# Altium schematic sheet OMD_CAN_VERT.SchDoc
size A4; Organization: Altium Limited; Address1: L3, 12a Rodborough Rd; Address2: Frenchs Forest; Address3: NSW; Address4: Australia 2086
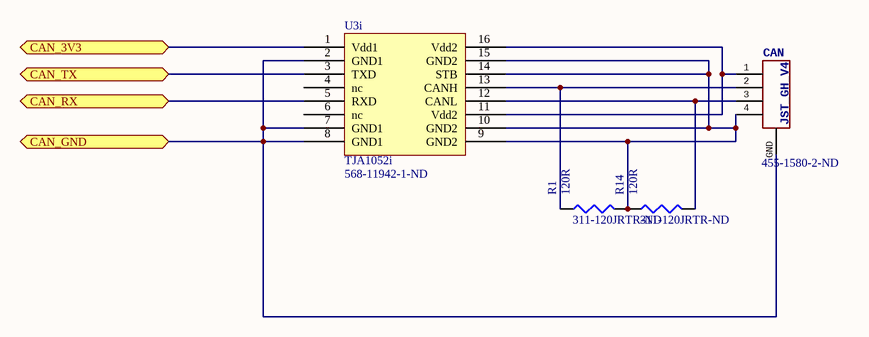
[diagram p0: OMD_CAN_VERT.SchDoc]

## Parts
CAN  JST_GH_V4  Supplier Part Number 1: 455-1580-2-ND  [JST_GH_V4]
R1  value 120R  Supplier Part Number 1: 311-120JRTR-ND  [R0402]  (hidden comment: RES SMD 120 OHM 5% 1/16W 0402)  (no BOM)
R14  value 120R  Supplier Part Number 1: 311-120JRTR-ND  [R0402]  (hidden comment: RES SMD 120 OHM 5% 1/16W 0402)  (no BOM)
U3i  TJA1052i  Supplier Part Number 1: 568-11942-1-ND  [TJA1052i]

## Ports
CAN_3V3, CAN_GND, CAN_RX, CAN_TX

## Nets
CAN_3V3: U3i.1(Vdd1) ; port CAN_3V3
CAN_GND: CAN.GND U3i.2(GND1) U3i.7(GND1) U3i.8(GND1) ; port CAN_GND
CAN_RX: U3i.5(RXD) ; port CAN_RX
CAN_TX: U3i.3(TXD) ; port CAN_TX
NetCAN_1: CAN.1 U3i.11(Vdd2) U3i.16(Vdd2)
NetCAN_2: CAN.2 R1.1 U3i.13(CANH)
NetCAN_3: CAN.3 R14.2 U3i.12(CANL)
NetCAN_4: CAN.4 R1.2 R14.1 U3i.9(GND2) U3i.10(GND2) U3i.14(STB) U3i.15(GND2)

Not connected (* = marked no-connect by the designer): U3i 4(nc) 6(nc)

## Notes on the sheet
- https://github.com/OpenMotorDrive
- https://creativecommons.org/licenses/by-nc-sa/4.0/
- For Commercial use, please contact ProfiCNC
- Title
- Size:
- Date:
- A4
- Number:
- Time:
- Revision:
- Sheet
- of
- ProfiCNC Pty. Ltd.
- ProfiCNC does NOT guaranty these drawings as fit for any purpose, you must verify this information before attempting to use it in any way.  USE AT OWN RISK
- File:

## Library data of the parts
CAN = JST_GH_V4: BM04B-GHS-TBT; Supplier 1: Digi-Key
R1 R14 = Resistor: Supplier 1: Digi-Key
U3i = TJA1052i: Supplier 1: Digi-Key